# EAGLE design v5 (EAGLE 6.3)

## Sheet 1 of 3
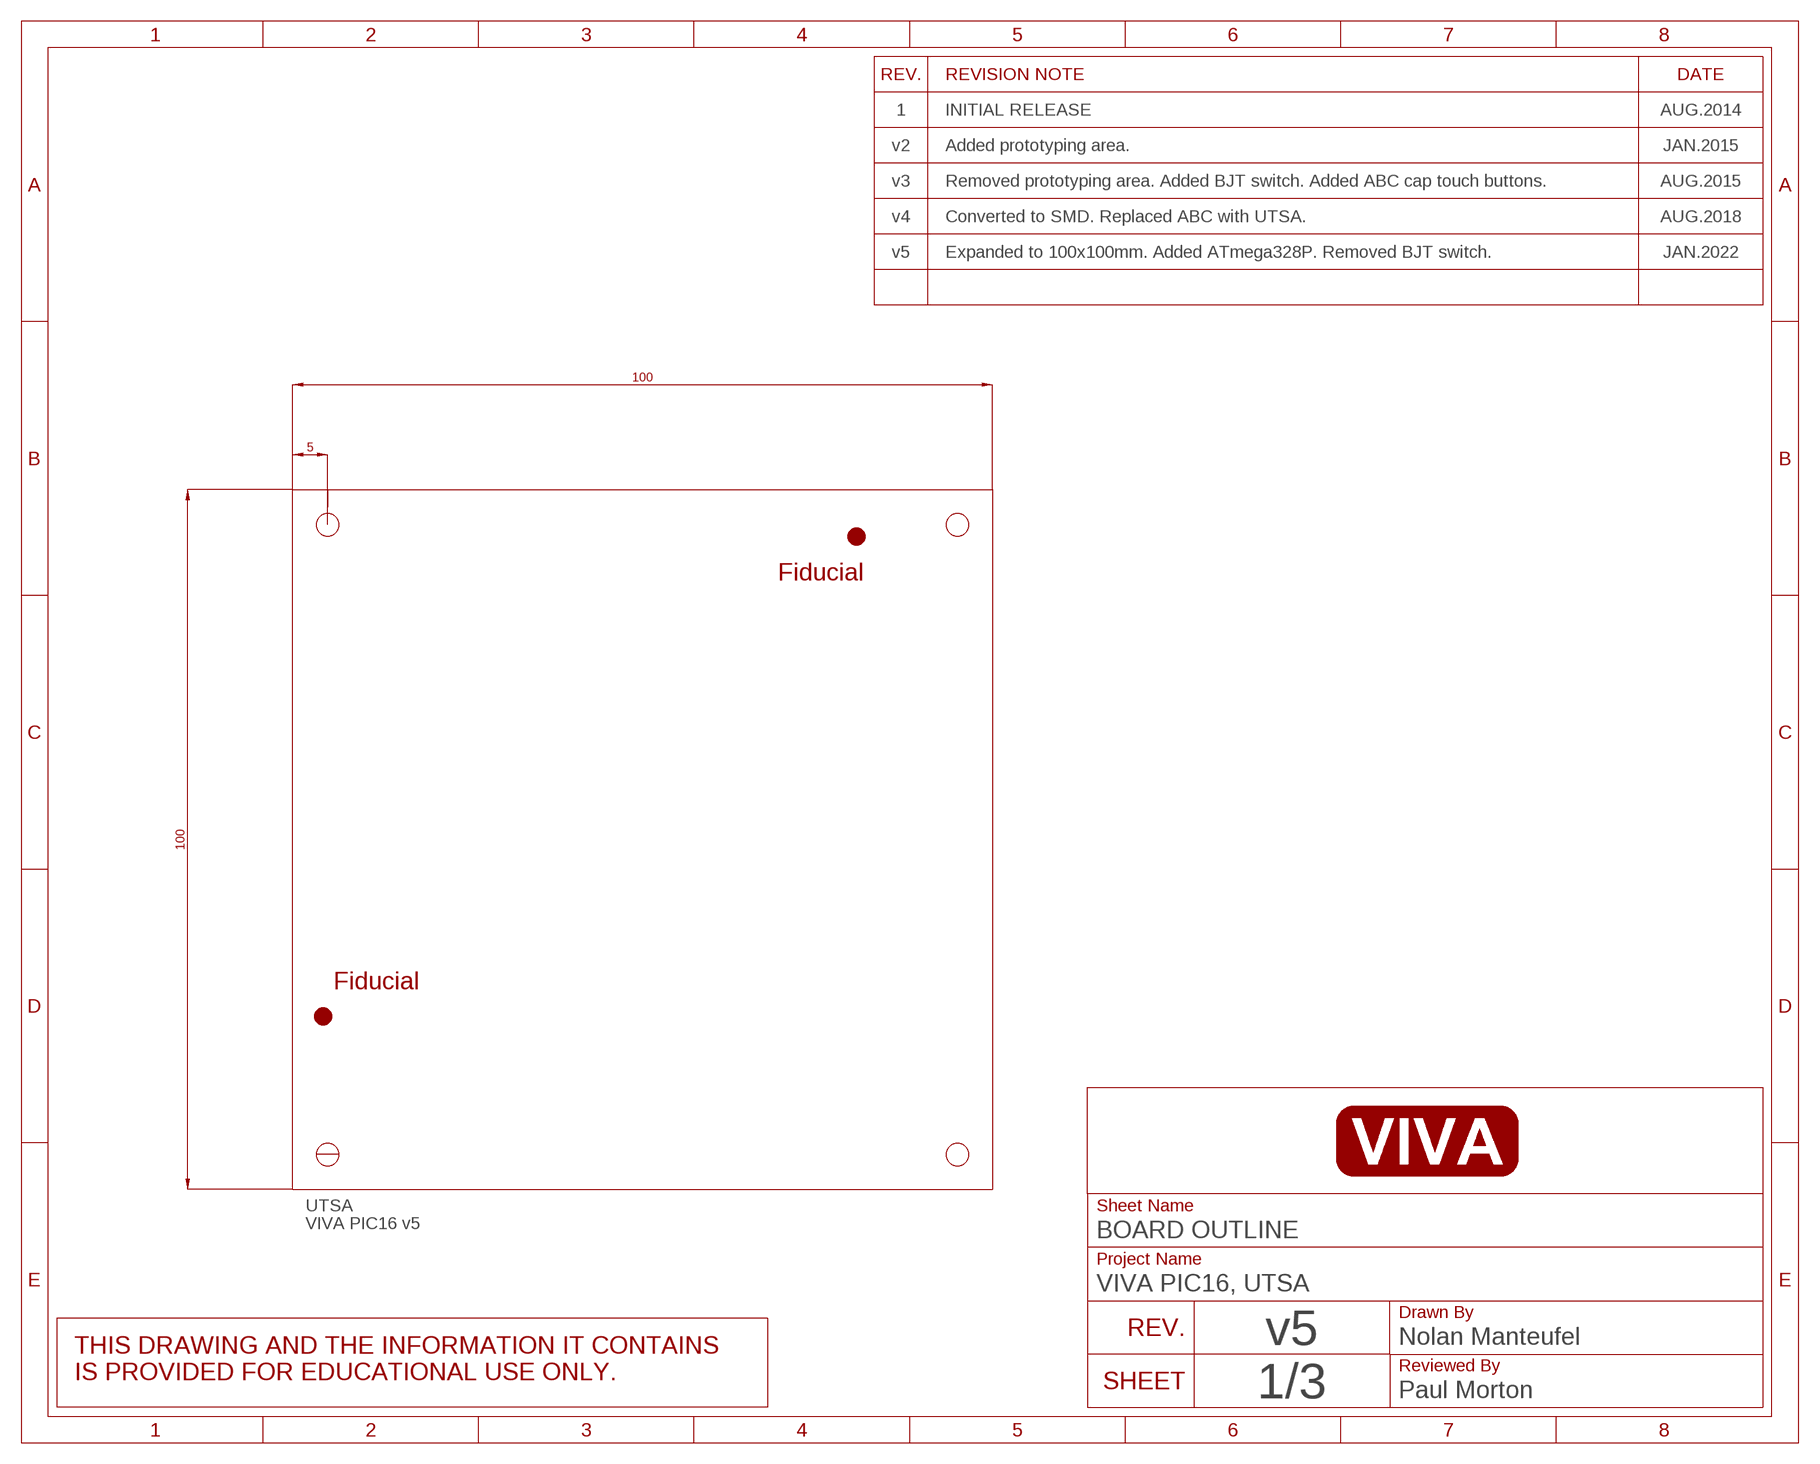
[diagram p0: schematic, sheet 1]
U$1 (SCHEMATIC_VIVA): DRAWN_BY: Nolan Manteufel; PROJECT: VIVA PIC16, UTSA; REVA: 1; REVA_DATE: AUG.2014; REVA_NOTE: INITIAL RELEASE; REVB: v2; REVB_DATE: JAN.2015; REVB_NOTE: Added prototyping area.; REVC: v3; REVC_DATE: AUG.2015; REVC_NOTE: Removed prototyping area. Added BJT switch. Added ABC cap touch buttons.; REVD: v4; REVD_DATE: AUG.2018; REVD_NOTE: Converted to SMD. Replaced ABC with UTSA.; REVE: v5; REVE_DATE: JAN.2022; REVE_NOTE: Expanded to 100x100mm. Added ATmega328P. Removed BJT switch.; REVIEWED_BY: Paul Morton; REVISION: v5

### Parts
A1  FIDUCIAL  [FIDUCIAL]
A2  FIDUCIAL  [FIDUCIAL]
UTSA  VIVA PIC16 v5  PCB_100X100  [PCB_100X100]

### Notes on the sheet
- Fiducial
- Fiducial

## Sheet 2 of 3
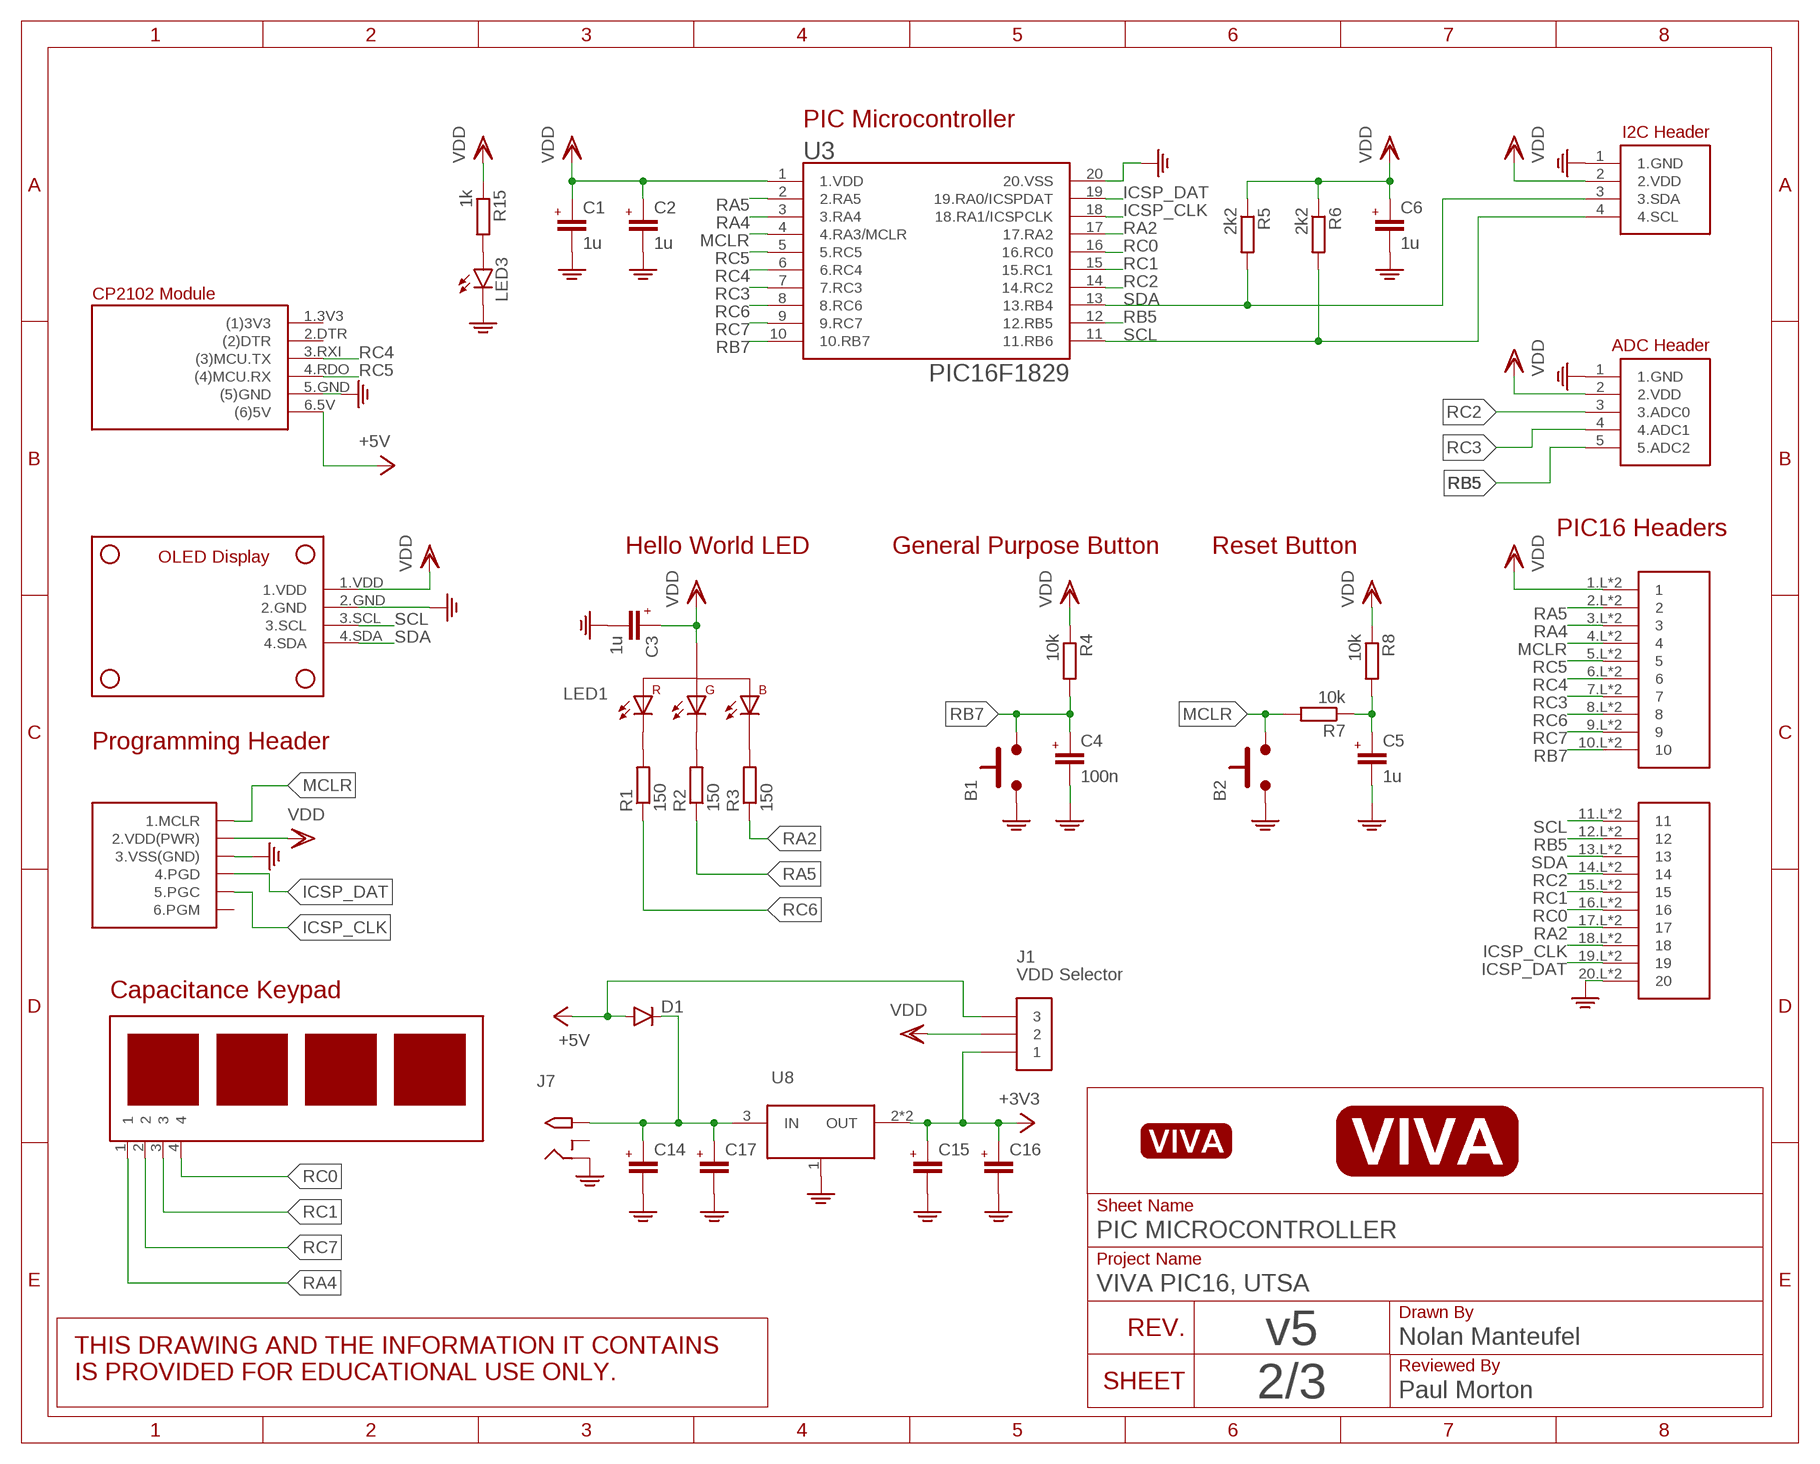
[diagram p1: schematic, sheet 2]
U$4 (SCHEMATIC_VIVA): DRAWN_BY: Nolan Manteufel; PROJECT: VIVA PIC16, UTSA; REVA: 1; REVA_DATE: AUG.2014; REVA_NOTE: INITIAL RELEASE; REVB: v2; REVB_DATE: JAN.2015; REVB_NOTE: Added prototyping area.; REVC: v3; REVC_DATE: AUG.2015; REVC_NOTE: Removed prototyping area. Added BJT switch. Added ABC cap touch buttons.; REVD: v4; REVD_DATE: AUG.2018; REVD_NOTE: Converted to SMD. Replaced ABC with UTSA.; REVE: v5; REVE_DATE: JAN.2022; REVE_NOTE: Expanded to 100x100mm. Added ATmega328P. Added battey pack.; REVIEWED_BY: Paul Morton; REVISION: v5

### Parts
B1  PUSHBUTTON6X6MM  [6X6MM]
B2  PUSHBUTTON6X6MM  [6X6MM]
C1  1u  C0805  [C0805]
C2  1u  C0805  [C0805]
C3  1u  C0805  [C0805]
C4  100n  C0805  [C0805]
C5  1u  C0805  [C0805]
C6  1u  C0805  [C0805]
C14  C0805  [C0805]
C15  C0805  [C0805]
C16  C0805  [C0805]
C17  C0805  [C0805]
D1  DIODE-DO214AC  [DO214AC]
J1  VDD Selector  PINS_3_2.54  [PINS_3]
J4  PICKIT3  [PICKIT3]
J5  VIVA-HEADER-ADC-PIC16  [VIVA-HEADER-ADC-PIC16]
J7  2.1MMJACKTHM  [PJ-102A]
LED1  LED_RGBLTST-C19FD1WT  [0805_RGB]
LED3  LEDSML0805  [SML0805]
R1  150  R-EU__R0805  [R0805]
R2  150  R-EU__R0805  [R0805]
R3  150  R-EU__R0805  [R0805]
R4  10k  R-EU__R0805  [R0805]
R5  2k2  R-EU__R0805  [R0805]
R6  2k2  R-EU__R0805  [R0805]
R7  10k  R-EU__R0805  [R0805]
R8  10k  R-EU__R0805  [R0805]
R15  1k  R-EU__R0805  [R0805]
U1  VIVA_UTSA-KEYPADV5  [VIVA_UTSA-KEYPAD-V5]
U2  VIVA_USB-TTL  [VIVA_USB_TTL_SUBTEXT]
U3  PIC16F1829  PIC16F1829300  [SOP20-NEW]
U4  VIVA-HEADER-I2C-RA  [VIVA-HEADER-I2C-RA]
U5  VIVA_PIC16BOARD  [VIVA_PIC16]
U8  REGULATOR_SCHLM1117  [SOT223]
U$2  VIVA_LOGO  [VIVA_LOGO]
U$3  VIVA_OLED  [VIVA_OLED-I2C]

### Nets
+3V3: C15.2(+) C16.2(+) J1.1 U8.2(OUT) U8.4.TAB(OUT)
+5V: D1.A J1.3 U2.6.5V((6)5V) ; also sheet 3
GND: B1.1.A B1.2.A B2.1.A B2.2.A C1.1(-) C2.1(-) C3.1(-) C4.1(-) C5.1(-) C6.1(-) C14.1(-) C15.1(-) C16.1(-) C17.1(-) J4.3(3.VSS(GND)) J5.1(1.GND) J7.RING LED3.C U2.5.GND((5)GND) U3.20(20.VSS) U4.1(1.GND) U5.20.L U5.20.R U8.1(GND) U$3.2.GND ; also sheet 3
ICSP_CLK: J4.5(5.PGC) U3.18(18.RA1/ICSPCLK) U5.18.L U5.18.R
ICSP_DAT: J4.4(4.PGD) U3.19(19.RA0/ICSPDAT) U5.19.L U5.19.R
MCLR: B2.3.B B2.4.B J4.1(1.MCLR) R7.2 U3.4(4.RA3/MCLR) U5.4.L U5.4.R
MCLR_CAP: C5.2(+) R7.1 R8.2
N$4: LED1.2(1.R-) R1.2
N$5: LED1.3(2.G-) R2.2
N$6: LED1.1(4.B-) R3.2
N$36: C14.2(+) C17.2(+) D1.C J7.TIP U8.3(IN)
N$38: LED3.A R15.2
RA2: R3.1 U3.17(17.RA2) U5.17.L U5.17.R
RA4: U1.1 U3.3(3.RA4) U5.3.L U5.3.R
RA5: R2.1 U3.2(2.RA5) U5.2.L U5.2.R
RB5: J5.5(5.ADC2) U3.12(12.RB5) U5.12.L U5.12.R
RB7: B1.3.B B1.4.B C4.2(+) R4.2 U3.10(10.RB7) U5.10.L U5.10.R
RC0: U1.4 U3.16(16.RC0) U5.16.L U5.16.R
RC1: U1.3 U3.15(15.RC1) U5.15.L U5.15.R
RC2: J5.3(3.ADC0) U3.14(14.RC2) U5.14.L U5.14.R
RC3: J5.4(4.ADC1) U3.7(7.RC3) U5.7.L U5.7.R
RC4: U2.3.RXI((3)MCU.TX) U3.6(6.RC4) U5.6.L U5.6.R
RC5: U2.4.RDO((4)MCU.RX) U3.5(5.RC5) U5.5.L U5.5.R
RC6: R1.1 U3.8(8.RC6) U5.8.L U5.8.R
RC7: U1.2 U3.9(9.RC7) U5.9.L U5.9.R
SCL: R6.2 U3.11(11.RB6) U4.4(4.SCL) U5.11.L U5.11.R U$3.3.SCL ; also sheet 3
SDA: R5.2 U3.13(13.RB4) U4.3(3.SDA) U5.13.L U5.13.R U$3.4.SDA ; also sheet 3
VDD: C1.2(+) C2.2(+) C3.2(+) C6.2(+) J1.2 J4.2(2.VDD(PWR)) J5.2(2.VDD) LED1.4(3.+) R4.1 R5.1 R6.1 R8.1 R15.1 U3.1(1.VDD) U4.2(2.VDD) U5.1.L U5.1.R U$3.1.VDD ; also sheet 3
Unconnected: J4.6(6.PGM) J7.RING_SW U2.1.3V3((1)3V3) U2.2.DTR((2)DTR)

### Notes on the sheet
- PIC Microcontroller
- PIC16 Headers
- Hello World LED | General Purpose Button | Reset Button
- Programming Header
- Capacitance Keypad

## Sheet 3 of 3
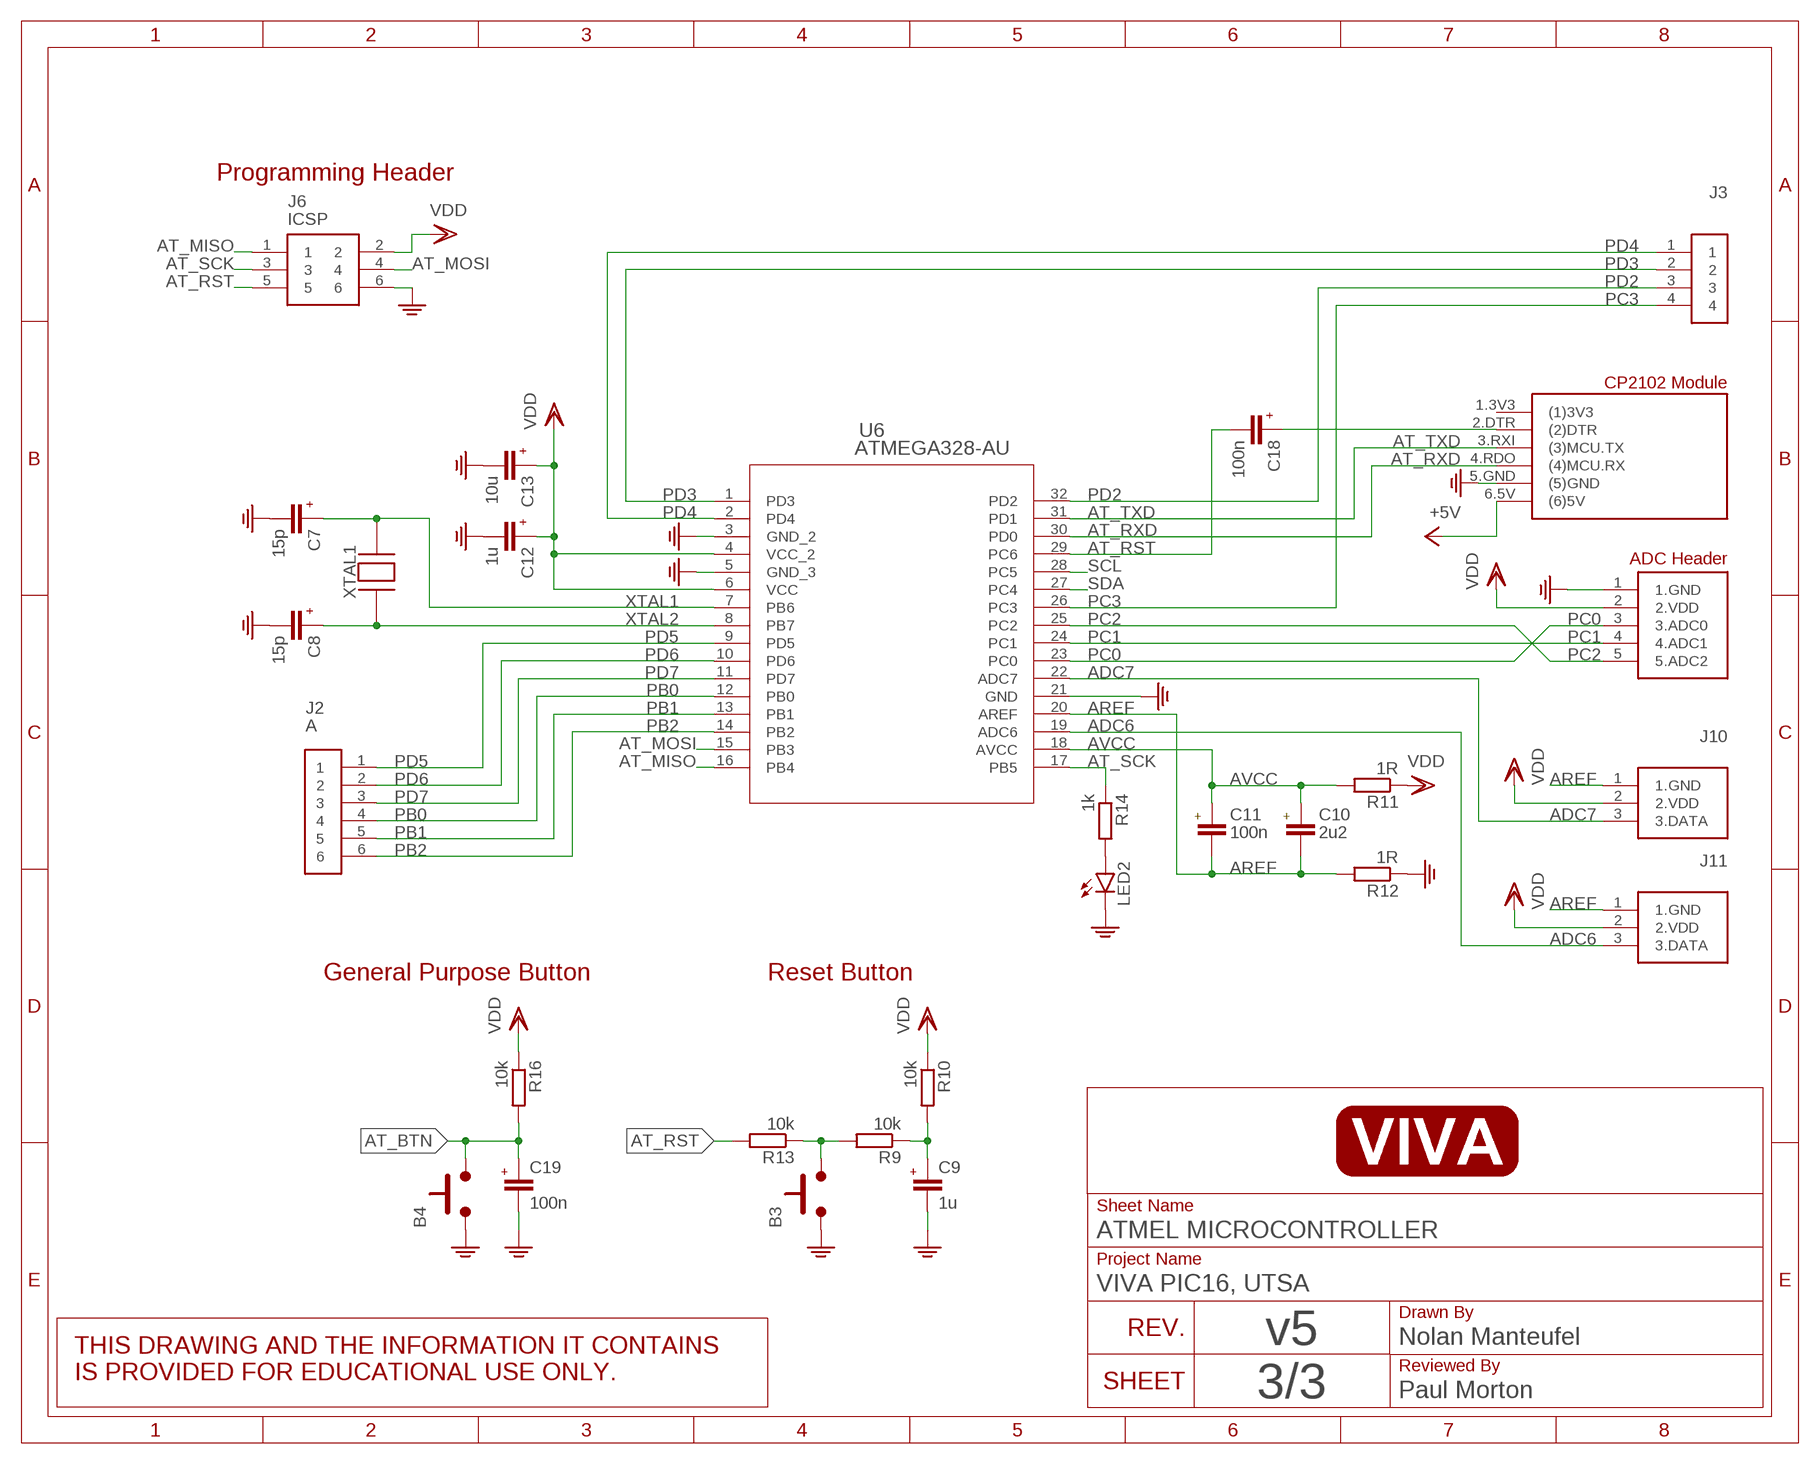
[diagram p2: schematic, sheet 3]
U$5 (SCHEMATIC_VIVA): DRAWN_BY: Nolan Manteufel; PROJECT: VIVA PIC16, UTSA; REVA: 1; REVA_DATE: AUG.2014; REVA_NOTE: INITIAL RELEASE; REVB: v2; REVB_DATE: JAN.2015; REVB_NOTE: Added prototyping area.; REVC: v3; REVC_DATE: AUG.2015; REVC_NOTE: Removed prototyping area. Added BJT switch. Added ABC cap touch buttons.; REVD: v4; REVD_DATE: AUG.2018; REVD_NOTE: Converted to SMD. Replaced ABC with UTSA.; REVE: v5; REVE_DATE: JAN.2022; REVE_NOTE: Expanded to 100x100mm. Added ATmega328P. Added battey pack.; REVIEWED_BY: Paul Morton; REVISION: v5

### Parts
B3  PUSHBUTTON6X6MM  [6X6MM]
B4  PUSHBUTTON6X6MM  [6X6MM]
C7  15p  C0603  [C0603]
C8  15p  C0603  [C0603]
C9  1u  C0805  [C0805]
C10  2u2  C-EU_C0805  [C0805]
C11  100n  C-EU_C0805  [C0805]
C12  1u  C0805  [C0805]
C13  10u  C0805  [C0805]
C18  100n  C0805  [C0805]
C19  100n  C0805  [C0805]
J2  A  PINS_6SQUARE  [PINS_6]
J3  PINS_4_0100  [PINS_4]
J6  ICSP  PINS_6-2X3  [PINS_6-2X3]
J9  VIVA-HEADER-ADC-PIC16  [VIVA-HEADER-ADC-PIC16]
J10  VIVA-HEADER-GPIO-1  [VIVA-HEADER-GPIO-RA-1]
J11  VIVA-HEADER-GPIO-1  [VIVA-HEADER-GPIO-RA-1]
LED2  LEDSML0805  [SML0805]
R9  10k  R-EU__R0805  [R0805]
R10  10k  R-EU__R0805  [R0805]
R11  1R  R-EU__R0805  [R0805]
R12  1R  R-EU__R0805  [R0805]
R13  10k  R-EU__R0805  [R0805]
R14  1k  R-EU__R0805  [R0805]
R16  10k  R-EU__R0805  [R0805]
U6  ATMEGA328-AU  [32A_ATM]
U7  VIVA_USB-TTL  [VIVA_USB_TTL_SUBTEXT]
XTAL1  CRYSTAL-SMD  [HC49S-SMD]

### Nets
+5V: U7.6.5V((6)5V) ; also sheet 2
ADC6: J11.3(3.DATA) U6.19(ADC6)
ADC7: J10.3(3.DATA) U6.22(ADC7)
AREF: C10.2 C11.2 J10.1(1.GND) J11.1(1.GND) R12.2 U6.20(AREF)
AT_BTN: B4.3.B B4.4.B C19.2(+) R16.2
AT_MISO: J6.1 U6.16(PB4)
AT_MOSI: J6.4 U6.15(PB3)
AT_RST: C18.1(-) J6.5 R13.2 U6.29(PC6)
AT_RST_BTN: B3.3.B B3.4.B R9.2 R13.1
AT_RST_CAP: C9.2(+) R9.1 R10.2
AT_RXD: U6.30(PD0) U7.4.RDO((4)MCU.RX)
AT_SCK: J6.3 R14.1 U6.17(PB5)
AT_TXD: U6.31(PD1) U7.3.RXI((3)MCU.TX)
AVCC: C10.1 C11.1 R11.2 U6.18(AVCC)
GND: B3.1.A B3.2.A B4.1.A B4.2.A C7.1(-) C8.1(-) C9.1(-) C12.1(-) C13.1(-) C19.1(-) J6.6 J9.1(1.GND) LED2.C R12.1 U6.3(GND_2) U6.5(GND_3) U6.21(GND) U7.5.GND((5)GND) ; also sheet 2
N$37: LED2.A R14.2
N$45: C18.2(+) U7.2.DTR((2)DTR)
PB0: J2.4 U6.12(PB0)
PB1: J2.5 U6.13(PB1)
PB2: J2.6 U6.14(PB2)
PC0: J9.3(3.ADC0) U6.23(PC0)
PC1: J9.4(4.ADC1) U6.24(PC1)
PC2: J9.5(5.ADC2) U6.25(PC2)
PC3: J3.4 U6.26(PC3)
PD2: J3.3 U6.32(PD2)
PD3: J3.2 U6.1(PD3)
PD4: J3.1 U6.2(PD4)
PD5: J2.1 U6.9(PD5)
PD6: J2.2 U6.10(PD6)
PD7: J2.3 U6.11(PD7)
SCL: U6.28(PC5) ; also sheet 2
SDA: U6.27(PC4) ; also sheet 2
VDD: C12.2(+) C13.2(+) J6.2 J9.2(2.VDD) J10.2(2.VDD) J11.2(2.VDD) R10.1 R11.1 R16.1 U6.4(VCC_2) U6.6(VCC) ; also sheet 2
XTAL1: C7.2(+) U6.7(PB6) XTAL1.2 XTAL1.4
XTAL2: C8.2(+) U6.8(PB7) XTAL1.1 XTAL1.3
Unconnected: U7.1.3V3((1)3V3)

### Notes on the sheet
- Programming Header
- General Purpose Button | Reset Button

## Library data of the parts
A1 A2 = utsa:FIDUCIAL
B1-B4 = nolan-utsa:PUSHBUTTON: Tactile push button switch
C1-C9 C12-C19 = utsa:C
C10 C11 = utsa:C-EU: CAPACITOR, European symbol
D1 = utsa:DIODE-: DIODE
J1 = utsa:PINS_3
J2 = utsa:PINS_6
J3 = utsa:PINS_4
J4 = nolan-viva:PICKIT3
J5 J9 = utsa:VIVA-HEADER-ADC
J6 = utsa:PINS_6-2X3
J7 = utsa:2.1MMJACK: 2.1mm x 5.5mm THM DC jack with internal switch. Digikey part #PJ-102A, 4UCON part #05537 2.1mm x 5.5mm SMT DC jack with internal switch. Digikey part #PJ-002A-SMT, 4UCON part #03267 By microbuilder.eu & adafruit.com
J10 J11 = utsa:VIVA-HEADER-GPIO-1
LED1 = utsa:LED_RGB
LED2 LED3 = utsa:LED: LED OSRAM: - CHIPLED LG R971, LG N971, LY N971, LG Q971, LY Q971, LO R971, LY R971 LH N974, LH R974 LS Q976, LO Q976, LY Q976 LO Q996 - Hyper CHIPLED LW Q18S LB Q993, LB Q99A, LB R99A - SideLED LS A670, LO A670, LY A670, LG A670, LP A670 LB A673, LV A673, LT A673, LW A673 LH A674 LY A675 LS A676, LA A676, LO A676, LY A676, LW A676 LS A679, LY A679, LG A679 - Hyper Micro SIDELED® LS Y876, LA Y876, LO Y876, LY Y876 LT Y87S - SmartLED LW L88C, LW L88S LB L89C, LB L89S, LG L890 LS L89K, LO L89K, LY L89K LS L896, LA L896, LO L896, LY L896 - TOPLED LS T670, LO T670, LY T670, LG T670, LP T670 LSG T670, LSP T670, LSY T670, LOP T670, LYG T670 LG T671, LOG T671, LSG T671 LB T673, LV T673, LT T673, LW T673 LH T674 LS T676, LA T676, LO T676, LY T676, LB T676, LH T676, LSB T676, LW T676 LB T67C, LV T67C, LT T67C, LS T67K, LO T67K, LY T67K, LW E67C LS E67B, LA E67B, LO E67B, LY E67B, LB E67C, LV E67C, LT E67C LW T67C LS T679, LY T679, LG T679 LS T770, LO T770, LY T770, LG T770, LP T770 LB T773, LV T773, LT T773, LW T773 LH T774 LS E675, LA E675, LY E675, LS T675 LS T776, LA T776, LO T776, LY T776, LB T776 LHGB T686 LT T68C, LB T68C - Hyper Mini TOPLED® LB M676 - Mini TOPLED Santana® LG M470 LS M47K, LO M47K, LY M47K Source: http://www.osram.convergy.de LUXEON: - LUMILED® LXK2-PW12-R00, LXK2-PW12-S00, LXK2-PW14-U00, LXK2-PW14-V00 LXK2-PM12-R00, LXK2-PM12-S00, LXK2-PM14-U00 LXK2-PE12-Q00, LXK2-PE12-R00, LXK2-PE12-S00, LXK2-PE14-T00, LXK2-PE14-U00 LXK2-PB12-K00, LXK2-PB12-L00, LXK2-PB12-M00, LXK2-PB14-N00, LXK2-PB14-P00, LXK2-PB14-Q00 LXK2-PR12-L00, LXK2-PR12-M00, LXK2-PR14-Q00, LXK2-PR14-R00 LXK2-PD12-Q00, LXK2-PD12-R00, LXK2-PD12-S00 LXK2-PH12-R00, LXK2-PH12-S00 LXK2-PL12-P00, LXK2-PL12-Q00, LXK2-PL12-R00 Source: www.luxeon.com KINGBRIGHT: KA-3528ASYC Source: www.kingbright.com
R1-R16 = utsa:R-EU_: RESISTOR, European symbol
U1 = utsa:VIVA_UTSA-KEYPAD
U2 U7 = utsa:VIVA_USB-TTL
U3 = utsa:PIC16F1829
U4 = utsa:VIVA-HEADER-I2C
U5 = utsa:VIVA_PIC16
U6 = utsa:ATMEGA328-AU; COPYRIGHT: Copyright (C) 2021 Ultra Librarian. All rights reserved.; MANUFACTURER_PART_NUMBER: ATMEGA328-AU; MFR_NAME: Microchip
U8 = utsa:REGULATOR_SCH: Linear Regulator in SOT-223 package. NOTE: select correct pinout for your application. Tab may be OUT or GND!
U$2 = utsa:VIVA_LOGO
U$3 = utsa:VIVA_OLED
UTSA = utsa:PCB_100X100
XTAL1 = utsa:CRYSTAL: HC49S Crystal Oscillator

## Board
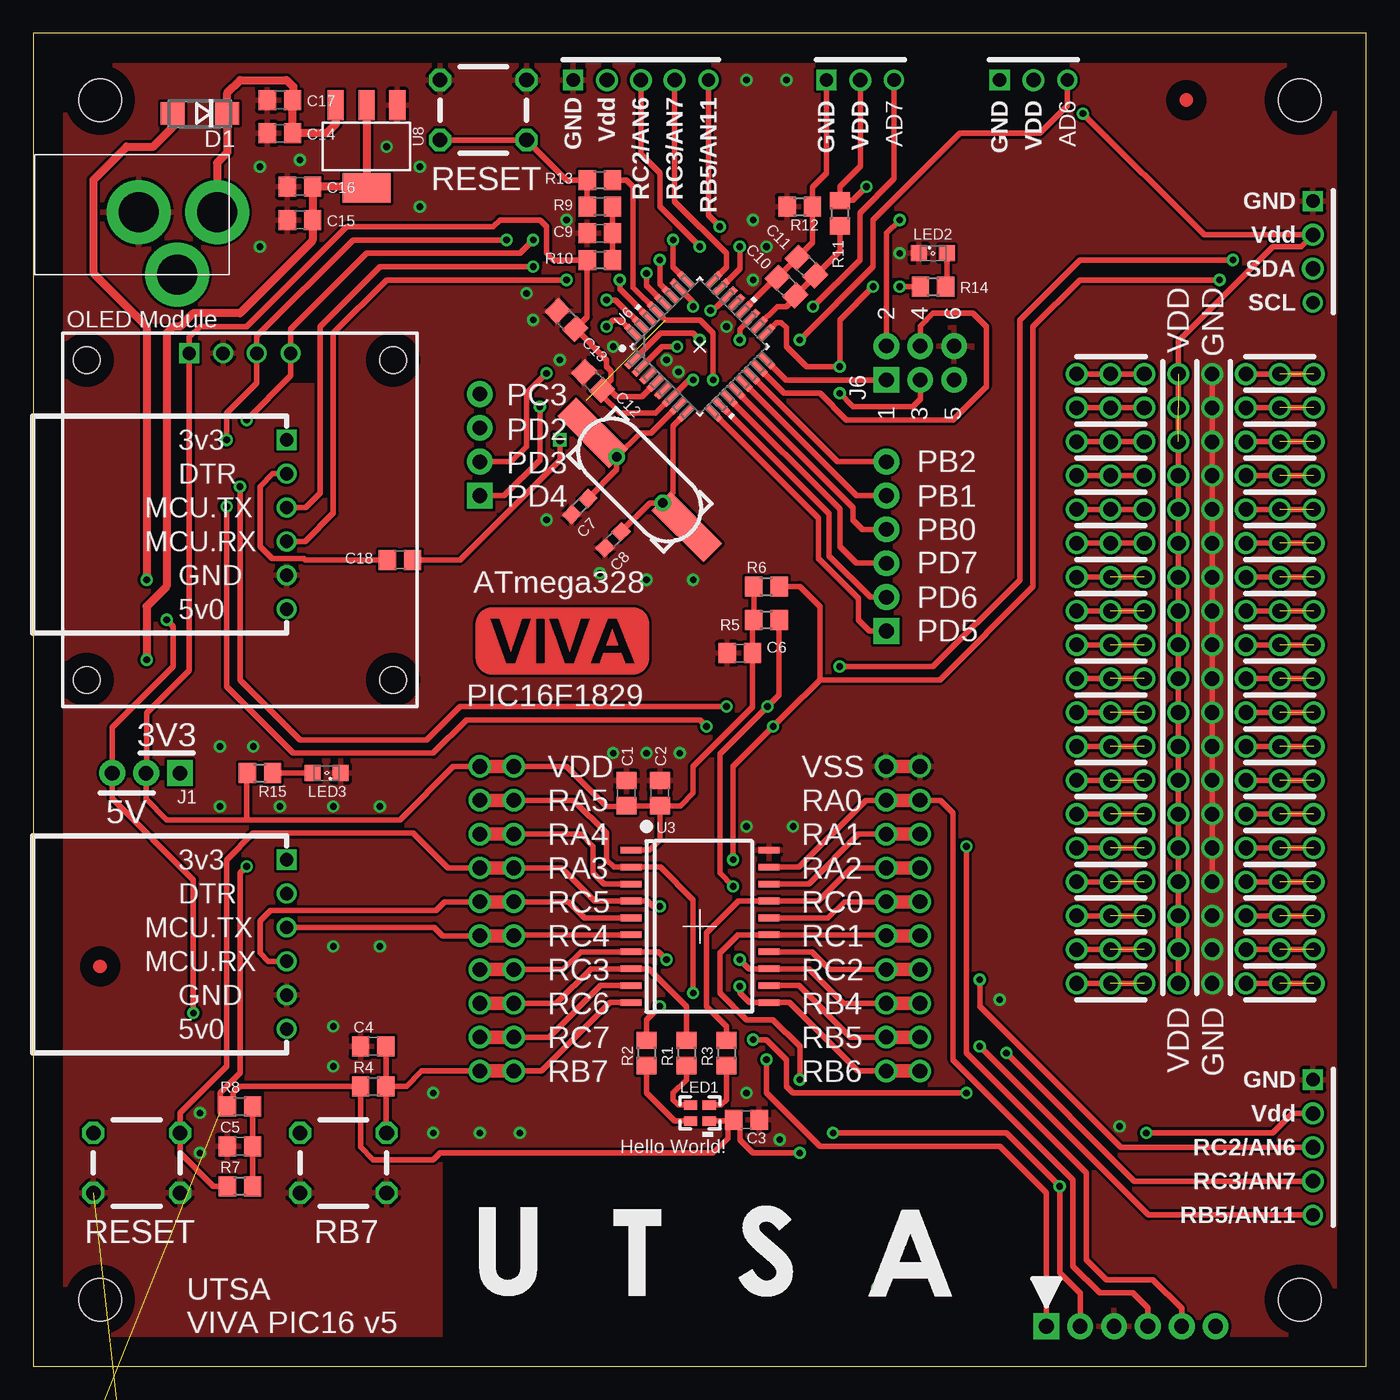
[diagram p3: board, top side]
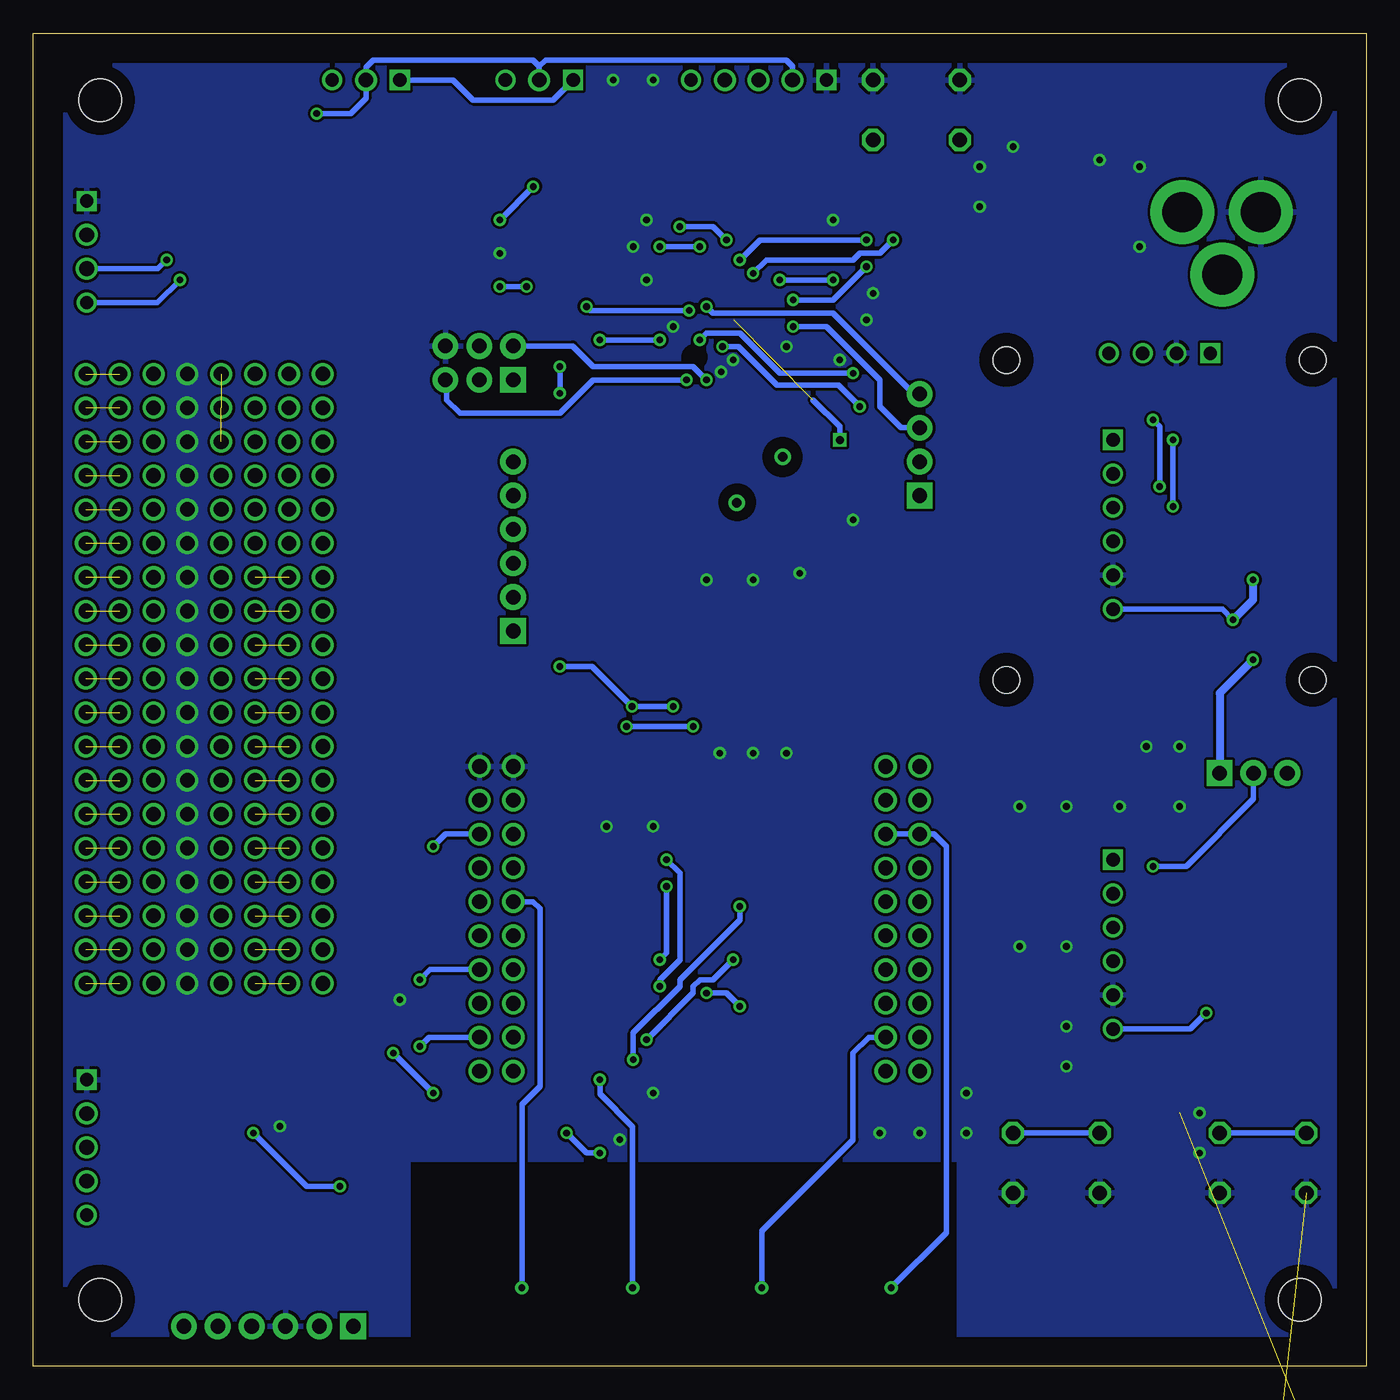
[diagram p4: board, bottom side, seen from below]

Size 100 x 100 mm. Coordinates in mm from the lower left corner, seen from the top.
Copper layers (1*2*15*16): Top 0.035mm / dielectric 0.2mm / Route2 0.035mm / dielectric 0.15mm / Route15 0.035mm / dielectric 0.2mm / Bottom 0.035mm
Design rules "default *": minimum track width 10mil, minimum drill 24mil, track to track 8mil, track to pad 8mil, pad to pad 8mil, via to via 8mil, smd to smd 8mil, copper to edge 40mil, drill to drill 8mil, minimum pad ring 10mil, minimum via ring 8mil, stop-mask expansion 4mil, vias tented up to drill 20mil, thermal gap 10mil
tRestrict: area 67.2,74.7 to 70.8,78.3; area 79.4,1.4 to 82.6,4.6; 2 lines
bRestrict: area 46,63.6 to 48.4,66; area 42.5,66.9 to 45.1,69.5; area 49.6,74.9 to 51.2,76.5

### Footprints (pad centres in the part's own frame; a part is rotated, then mirrored left to right if it is on the bottom)
FIDUCIAL = smd 0 x 0: FIDUCIAL 0,0
6X6MM = drill 1.1 octagon: 1.A 0,0; 2.A 6.5,0; 3.B 0,4.5; 4.B 6.5,4.5
C0805 = smd 1.3 x 1.5: 1 -0.95,0; 2 0.95,0
C0603 = smd 1.1 x 1: 1 -0.85,0; 2 0.85,0
DO214AC = smd 1.8 x 1.7: A 2.05,0; C -2.05,0
PINS_3 = drill 1.1 pad 1.93 square: 1 0,0 | drill 1.1 pad 1.93: 2 2.54,0; 3 5.08,0
PINS_6 = drill 1.1 pad 1.93 square: 1 0,0 | drill 1.1 pad 1.93: 2 2.54,0; 3 5.08,0; 4 7.62,0; 5 10.16,0; 6 12.7,0
PINS_4 = drill 1.1 pad 1.93 square: 1 0,0 | drill 1.1 pad 1.93: 2 2.54,0; 3 5.08,0; 4 7.62,0
PICKIT3 = drill 1.1 pad 1.93 square: 1 0,0 | drill 1.1 pad 1.93: 2 2.54,0; 3 5.08,0; 4 7.62,0; 5 10.16,0; 6 12.7,0
VIVA-HEADER-ADC-PIC16 = drill 1 square: 1 0,0 | drill 1.1: 2 2.54,0; 3 5.08,0; 4 7.62,0 | drill 1: 5 10.16,0
PINS_6-2X3 = drill 1.1 pad 1.93 square: 1 0,0 | drill 1.1 pad 1.93: 2 2.54,0; 3 0,-2.54; 4 2.54,-2.54; 5 0,-5.08; 6 2.54,-5.08
PJ-102A = drill 3 pad 4.8: RING 0.1,-3.39; RING_SW -4.6,-6.29; TIP 0.1,-9.29
VIVA-HEADER-GPIO-RA-1 = drill 1 square: 1 0,0 | drill 1.1: 2 0,-2.54 | drill 1: 3 0,-5.08
0805_RGB = smd 1 x 0.7: 1 0.7,0.6; 2 -0.7,0.6; 3 -0.7,-0.6; 4 0.7,-0.6
SML0805 = smd 1.2 x 1.2: A 1.05,0; C -1.05,0
R0805 = smd 1.3 x 1.5: 1 -0.95,0; 2 0.95,0
VIVA_UTSA-KEYPAD-V5 = drill 0.5: 1 -14.36,4.38; 2 -4.66,4.38; 3 5.04,4.38; 4 13.34,4.38
VIVA_USB_TTL_SUBTEXT = drill 1 square: 1.3V3 0,0 | drill 1: 2.DTR 0,-2.54; 3.RXI 0,-5.08; 4.RDO 0,-7.62; 5.GND 0,-10.16; 6.5V 0,-12.7
SOP20-NEW = smd 0.5 x 1.6: 1 -5.715,-5.152; 2 -4.445,-5.152; 3 -3.175,-5.152; 4 -1.905,-5.152; 5 -0.635,-5.152; 6 0.635,-5.152; 7 1.905,-5.152; 8 3.175,-5.152; 9 4.445,-5.152; 10 5.715,-5.152; 11 5.715,5.188; 12 4.445,5.188; 13 3.175,5.188; 14 1.905,5.188; 15 0.635,5.188; 16 -0.635,5.188; 17 -1.905,5.188; 18 -3.175,5.188; 19 -4.445,5.188; 20 -5.715,5.188
VIVA-HEADER-I2C-RA = drill 1 square: 1 0,0 | drill 1.1: 2 2.54,0; 3 5.08,0 | drill 1: 4 7.62,0
VIVA_PIC16 = drill 1.1 pad 1.676: 1.L 0,0; 1.R 2.54,0; 2.L 0,-2.54; 2.R 2.54,-2.54; 3.L 0,-5.08; 3.R 2.54,-5.08; 4.L 0,-7.62; 4.R 2.54,-7.62; 5.L 0,-10.16; 5.R 2.54,-10.16; 6.L 0,-12.7; 6.R 2.54,-12.7; 7.L 0,-15.24; 7.R 2.54,-15.24; 8.L 0,-17.78; 8.R 2.54,-17.78; 9.L 0,-20.32; 9.R 2.54,-20.32; 10.L 0,-22.86; 10.R 2.54,-22.86; 11.L 30.48,-22.86; 11.R 33.02,-22.86; 12.L 30.48,-20.32; 12.R 33.02,-20.32; 13.L 30.48,-17.78; 13.R 33.02,-17.78; 14.L 30.48,-15.24; 14.R 33.02,-15.24; 15.L 30.48,-12.7; 15.R 33.02,-12.7; 16.L 30.48,-10.16; 16.R 33.02,-10.16; 17.L 30.48,-7.62; 17.R 33.02,-7.62; 18.L 30.48,-5.08; 18.R 33.02,-5.08; 19.L 30.48,-2.54; 19.R 33.02,-2.54; 20.L 30.48,0; 20.R 33.02,0
32A_ATM = smd 1.461 x 0.501: 1 -4.25,2.8; 2 -4.25,2; 3 -4.25,1.2; 4 -4.25,0.4; 5 -4.25,-0.4; 6 -4.25,-1.2; 7 -4.25,-2; 8 -4.25,-2.8; 17 4.25,-2.8; 18 4.25,-2; 19 4.25,-1.2; 20 4.25,-0.4; 21 4.25,0.4; 22 4.25,1.2; 23 4.25,2; 24 4.25,2.8 | smd 0.501 x 1.461: 9 -2.8,-4.25; 10 -2,-4.25; 11 -1.2,-4.25; 12 -0.4,-4.25; 13 0.4,-4.25; 14 1.2,-4.25; 15 2,-4.25; 16 2.8,-4.25; 25 2.8,4.25; 26 2,4.25; 27 1.2,4.25; 28 0.4,4.25; 29 -0.4,4.25; 30 -1.2,4.25; 31 -2,4.25; 32 -2.8,4.25
SOT223 = smd 1.219 x 2.235: 1 -2.311,-3.099; 2 0,-3.099; 3 2.311,-3.099 | smd 3.6 x 2.2: 4.TAB 0,3.099
VIVA_OLED-I2C = drill 1 square: 1.VDD -3.81,12.5 | drill 1: 2.GND -1.27,12.5; 3.SCL 1.27,12.5; 4.SDA 3.81,12.5 | hole 2: -11.5,12; 11.5,12; -11.5,-12; 11.5,-12
PCB_100X100 = hole 3.2: 5,95; 95,95; 95,5; 5,5
HC49S-SMD = drill 0.7: 1 -2.44,0; 2 2.44,0 | smd 5.5 x 2: 3 -5,0; 4 5,0

### Placement (x,y rotation side)
A1  86.5,95 0 top
A2  5,30 0 top
B1  20,13 0 top
B2  4.5,13 0 top
B3  37,96.5 180 top
B4  0.5,-9.5 0 top  (outside the outline)
C1  44.5,43 270 top
C2  47,43 270 top
C3  53.5,18.5 180 top
C4  25.5,24 0 top
C5  15.5,16.5 0 top
C6  53,53.5 0 top
C7  41,64.5 45 top
C8  43.5,62 45 top
C9  42.5,85 0 top
C10  56.5,81 135 top
C11  58,82.5 135 top
C12  42,73.9 315 top
C13  40,78.5 315 top
C14  18.5,92.5 0 top
C15  20,86 0 top
C16  20,88.5 0 top
C17  18.5,95 0 top
C18  27.5,60.5 180 top
C19  1.5,-12 0 top  (outside the outline)
D1  12.5,94 180 top
J1  11,44.5 180 top
J2  64,55.16 90 top
J3  33.5,65.32 90 top
J4  76,3 0 top
J5  96,21.5 270 top
J6  64,74 90 top
J7  4.5,86.5 90 top
J9  40.5,96.5 0 top
J10  59.5,96.5 90 top
J11  72.5,96.5 90 top
LED1  50,19 0 top
LED2  67.5,83.5 0 top
LED3  22,44.5 180 top
R1  49,23.5 270 top
R2  46,23.5 270 top
R3  52,23.5 270 top
R4  25.5,21 0 top
R5  55,56 0 top
R6  55,58.5 0 top
R7  15.5,13.5 180 top
R8  15.5,19.5 0 top
R9  42.5,87 180 top
R10  42.5,83 0 top
R11  60.5,86.5 270 top
R12  57.5,87 0 top
R13  42.5,89 0 top
R14  67.5,81 0 top
R15  17,44.5 0 top
R16  1.5,-14.5 0 top  (outside the outline)
U1  50,1.5 0 top
U2  19,38 0 top
U3  50,33 270 top
U4  96,87.42 270 top
U5  33.5,45 0 top
U6  50,76.5 45 top
U7  19,69.5 0 top
U8  25,91.5 180 top
U$2  33.2,51.9 0 top
U$3  15.5,63.5 0 top
UTSA  0,0 0 top
XTAL1  45.5,66.5 135 top

### Tracks (layer width: path | path; a pad name or v marks a point on that pad's centre or on a via)
+3V3  (via drill 0.5)
  Top 0.61: U8.2 U8.4.TAB 23.9,88.4 23.5,88.5 C16.2 C15.2 20.95,84.45 15.5,79 12,79 11,78 10.5,78 10,77.5 10,58.5 8.5,57 v8.5,53
  Bottom 0.61: v8.5,53 11,50.5 J1.1
+5V  (via drill 0.5)
  Top 0.406: v12,26.5 12,36.5 5.92,42.58 J1.3 5.92,47.92 10.5,52.5 10.5,55.5 v10,56
  Top 0.61: v8.5,59 8.5,78 4.5,82 4.5,89 7,91.5 9,91.5 10.45,92.95 D1.A
  Bottom 0.406: U2.6.5V 13.2,25.3 v12,26.5 | v10,56 10.8,56.8 U7.6.5V
  Bottom 0.61: v8.5,59 8.5,57.5 v10,56
ADC6  (via drill 0.5)
  Top 0.406: U6.19 53,77.8 v53,77 | v57.5,77 63,82.5 63,86 69.5,92.5 75.5,92.5 77.58,94.58 J11.3
  Bottom 0.406: v53,77 v57.5,77
ADC7  (via drill 0.5)
  Top 0.406: U6.22 51.3,79.5 v50.8,79.2 | v58.5,79.5 62,83 62,86.5 64.58,89.08 J10.3
  Bottom 0.406: v50.8,79.2 58.2,79.2 v58.5,79.5
AREF
  Top 0.406: U6.20 55.74,81.67 C10.2 C11.2 58.45,84.29 R12.2 58.45,88.45 59.5,89.5 J10.1
  Bottom 0.406: J11.1 68.5,96.5 67,95 61,95 J10.1
AT_BTN  (3 unrouted)
AT_MISO
  Top 0.406: J6.1 56.46,74 U6.16
AT_MOSI
  Top 0.406: J6.4 66.54,78.04 67.5,79 70.5,79 71.5,78 71.5,73.5 69,71 61,71 59,73 56.33,73 U6.15
AT_RST  (via drill 0.5, 0.6)  (1 unrouted)
  Top 0.406: R13.2 44.5,89 45,88.5 45,80.93 U6.29 47.43,78.5 50,78.5 51,77.5 v51,74 | C18.1 32,60.5 39.5,68 v39.5,69.5
  Bottom 0.406: J6.5 69,73.92 69,72.5 68,71.5 60.5,71.5 58,74 v51,74 | v39.5,69.5 39.5,70.5 41.5,72.5
AT_RST_BTN
  Top 0.406: R9.2 R13.1 40,89 B3.3.B B3.4.B
AT_RST_CAP
  Top 0.406: R9.1 C9.2 R10.2
AT_RXD  (via drill 0.5)
  Top 0.406: U7.4.RDO 20.38,61.88 22.5,64 22.5,77.5 26.5,81.5 v40,81.5 | U6.30 44,80.8 v44,81.5
  Bottom 0.406: v44,81.5 v40,81.5
AT_SCK  (via drill 0.5)
  Top 0.406: J6.3 66.54,72.54 66,72 61.5,72 v60.5,73 | U6.17 55.76,78.3 56.1,78.3 56.5,77.9 56.5,76.5 58,75 v60.5,75 60.5,78.5 v63,81 | R14.1 v65,81
  Bottom 0.406: v60.5,73 v60.5,75 | v65,81 v63,81
AT_TXD  (via drill 0.5)
  Top 0.406: U7.3.RXI 20.42,64.42 21.5,65.5 21.5,78 26,82.5 v37.5,82.5 | U6.31 43.67,80 v43,80
  Bottom 0.406: v43,80 40,80 v37.5,82.5
AVCC
  Top 0.406: U6.18 55.83,79.5 56.5,79.5 57.17,80.17 C10.1 C11.1 60.5,83.66 R11.2
GND  (via drill 0.5, 1.1)  (3 unrouted)
  Top 0.406: v88.44,36.34 v88.44,74.44
  other vias: 53.5,40.5 57,40.5 72.5,27.5 56,17 53.5,20.5 43.5,46 46,46 48.5,46 12.5,19 12.5,16 30,20.5 30,17.5 33.5,17.5 36.5,17.5 22.5,22.5 22.5,25.5 22.5,31.5 26,31.5 26,42 22.5,42 54,81.5 55,84 53.5,96.5 47.5,75.5 48.4,74.6 38.5,63.5 42.5,59.5 37.5,78.5 40,86 81.5,18 52,78 37,80.5 39.5,75.5 88.44,71.9 88.44,69.36 88.44,66.82 88.44,64.28 88.44,61.74 88.44,59.2 88.44,56.66 88.44,54.12 88.44,51.58 88.44,49.04 88.44,46.5 88.44,43.96 88.44,41.42 88.44,38.88 43.5,76.5 65,83.5 56.5,96.5 54,86 16.5,46.5 14,46.5 18.5,42 14,42 26.5,91.5 29,90 17,90 29,87 17,84 20,90.5 49.5,59 46,59 88.44,33.8 88.44,31.26 88.44,28.72
  pour Top: 2,2 98,2 98,98 2,98
  pour Bottom: 2,2 98,2 98,98 2,98
ICSP_CLK  (via drill 0.5)
  Top 0.406: U5.18.L 61.92,39.92 58.17,36.17 U3.18 | J4.5 86.16,4.34 84,6.5 80.5,6.5 79,8 79,14.5 70,23.5 v70,39
  Bottom 0.406: v70,39 69.08,39.92 U5.18.R
ICSP_DAT
  Top 0.406: U3.19 57.45,37.45 62.46,42.46 U5.19.R 68.04,42.46 69,41.5 69,23 78,14 78,7.5 80,5.5 82.5,5.5 83.62,4.38 J4.4
MCLR  (via drill 0.5)
  Top 0.406: J4.1 76,13 72.5,16.5 59,16.5 55,20.5 v55,23 | R7.2 13.5,13.5 11,16 B2.4.B 11,19 14.5,22.5 14.5,38 16.5,40 28.5,40 31.12,37.38 U5.4.L 39.62,37.38 42.09,34.91 U3.4 46.09,34.91 46.5,34.5 v47,34.5
  Bottom 0.406: v55,23 55,25 51.5,28.5 51.5,29 47,33.5 v47,34.5 | B2.3.B B2.4.B
MCLR_CAP
  Top 0.406: R7.1 C5.2 R8.2
N$1  (via drill 1.1)  (1 unrouted)
  Top 0.406: v90.98,36.34 v96.06,36.34
  other vias: 93.52,36.34
N$2  (via drill 1.1)  (1 unrouted)
  Top 0.406: v90.98,38.88 v96.06,38.88
  other vias: 93.52,38.88
N$3  (via drill 1.1)  (1 unrouted)
  Top 0.406: v90.98,41.42 v96.06,41.42
  other vias: 93.52,41.42
N$4
  Top 0.406: LED1.2 48.4,19.6 48,20 48,20.5 49,21.5 R1.2
N$5
  Top 0.406: LED1.3 48.1,18.4 46,20.5 R2.2
N$6
  Top 0.406: R3.2 52,20 51.6,19.6 LED1.1
N$7  (via drill 1.1)  (1 unrouted)
  Top 0.406: v90.98,43.96 v96.06,43.96
  other vias: 93.52,43.96
N$8  (via drill 1.1)  (1 unrouted)
  Top 0.406: v90.98,46.5 v96.06,46.5
  other vias: 93.52,46.5
N$9  (via drill 1.1)  (1 unrouted)
  Top 0.406: v90.98,49.04 v96.06,49.04
  other vias: 93.52,49.04
N$10  (via drill 1.1)  (1 unrouted)
  Top 0.406: v90.98,51.58 v96.06,51.58
  other vias: 93.52,51.58
N$11  (via drill 1.1)  (1 unrouted)
  Top 0.406: v90.98,54.12 v96.06,54.12
  other vias: 93.52,54.12
N$12  (via drill 1.1)  (1 unrouted)
  Top 0.406: v90.98,56.66 v96.06,56.66
  other vias: 93.52,56.66
N$13  (via drill 1.1)  (1 unrouted)
  Top 0.406: v90.98,59.2 v96.06,59.2
  other vias: 93.52,59.2
N$14  (via drill 1.1)  (1 unrouted)
  Top 0.406: v90.98,61.74 v96.06,61.74
  other vias: 93.52,61.74
N$15  (via drill 1.1)  (1 unrouted)
  Top 0.406: v90.98,64.28 v96.06,64.28
  other vias: 93.52,64.28
N$16  (via drill 1.1)  (1 unrouted)
  Top 0.406: v90.98,66.82 v96.06,66.82
  other vias: 93.52,66.82
N$17  (via drill 1.1)  (1 unrouted)
  Top 0.406: v90.98,69.36 v96.06,69.36
  other vias: 93.52,69.36
N$18  (via drill 1.1)  (1 unrouted)
  Top 0.406: v90.98,71.9 v96.06,71.9
  other vias: 93.52,71.9
N$19  (via drill 1.1)  (1 unrouted)
  Top 0.406: v90.98,74.44 v96.06,74.44
  other vias: 93.52,74.44
N$20  (via drill 1.1)  (1 unrouted)
  Top 0.406: v78.28,36.34 v83.36,36.34
  other vias: 80.82,36.34
N$21  (via drill 1.1)  (1 unrouted)
  Top 0.406: v78.28,38.88 v83.36,38.88
  other vias: 80.82,38.88
N$22  (via drill 1.1)  (1 unrouted)
  Top 0.406: v78.28,41.42 v83.36,41.42
  other vias: 80.82,41.42
N$23  (via drill 1.1)  (1 unrouted)
  Top 0.406: v78.28,43.96 v83.36,43.96
  other vias: 80.82,43.96
N$24  (via drill 1.1)  (1 unrouted)
  Top 0.406: v78.28,46.5 v83.36,46.5
  other vias: 80.82,46.5
N$25  (via drill 1.1)  (1 unrouted)
  Top 0.406: v78.28,49.04 v83.36,49.04
  other vias: 80.82,49.04
N$26  (via drill 1.1)  (1 unrouted)
  Top 0.406: v78.28,51.58 v83.36,51.58
  other vias: 80.82,51.58
N$27  (via drill 1.1)  (1 unrouted)
  Top 0.406: v78.28,54.12 v83.36,54.12
  other vias: 80.82,54.12
N$28  (via drill 1.1)  (1 unrouted)
  Top 0.406: v78.28,56.66 v83.36,56.66
  other vias: 80.82,56.66
N$29  (via drill 1.1)  (1 unrouted)
  Top 0.406: v78.28,59.2 v83.36,59.2
  other vias: 80.82,59.2
N$30  (via drill 1.1)
  Top 0.406: v78.28,61.74 v80.82,61.74 v83.36,61.74
N$31  (via drill 1.1)
  Top 0.406: v78.28,64.28 v80.82,64.28 v83.36,64.28
N$32  (via drill 1.1)
  Top 0.406: v78.28,66.82 v80.82,66.82 v83.36,66.82
N$33  (via drill 1.1)
  Top 0.406: v78.28,69.36 v80.82,69.36 v83.36,69.36
N$34  (via drill 1.1)
  Top 0.406: v78.28,71.9 v80.82,71.9 v83.36,71.9
N$35  (via drill 1.1)
  Top 0.406: v78.28,74.44 v80.82,74.44 v83.36,74.44
N$36
  Top 0.61: J7.TIP 13.79,90.29 14.55,91.05 D1.C 14.55,95.55 15.5,96.5 19,96.5 19.5,96 19.5,94.65 C17.2 C14.2 22,92.5 22.69,93.19 U8.3
N$37
  Top 0.406: R14.2 68.55,81.1 LED2.A
N$38
  Top 0.406: LED3.A R15.2
N$39  (via drill 1.1)  (1 unrouted)
  Top 0.406: v78.28,28.72 v83.36,28.72
  other vias: 80.82,28.72
N$40  (via drill 1.1)  (1 unrouted)
  Top 0.406: v78.28,31.26 v83.36,31.26
  other vias: 80.82,31.26
N$41  (via drill 1.1)  (1 unrouted)
  Top 0.406: v78.28,33.8 v83.36,33.8
  other vias: 80.82,33.8
N$42  (via drill 1.1)  (1 unrouted)
  Top 0.406: v90.98,28.72 v96.06,28.72
  other vias: 93.52,28.72
N$43  (via drill 1.1)  (1 unrouted)
  Top 0.406: v90.98,31.26 v96.06,31.26
  other vias: 93.52,31.26
N$44  (via drill 1.1)  (1 unrouted)
  Top 0.406: v90.98,33.8 v96.06,33.8
  other vias: 93.52,33.8
N$45
  Top 0.406: C18.2 20.4,60.5 20.3,60.6 17.9,60.6 17,61.5 17,66 17.96,66.96 U7.2.DTR
PB0
  Top 0.406: U6.12 61.5,64.43 61.5,63.5 62.22,62.78 J2.4
PB1
  Top 0.406: U6.13 61.75,65.32 J2.5
PB2
  Top 0.406: U6.14 60.34,67.86 J2.6
PC0  (via drill 0.5)
  Top 0.406: U6.23 53,82.33 v53,84 | v50,84 47,87 47,89.5 45.58,90.92 J9.3
  Bottom 0.406: v53,84 v50,84
PC1
  Top 0.406: U6.24 52,82.46 52,83.5 48.12,87.38 J9.4
PC2  (via drill 0.5)
  Top 0.406: U6.25 48,82.46 v48,84.5 | v51.5,85.5 50.66,86.34 J9.5
  Bottom 0.406: v48,84.5 49,85.5 v51.5,85.5
PC3  (via drill 0.5)
  Top 0.406: v49.5,79.5 49.5,79.83 U6.26
  Bottom 0.406: v49.5,79.5 49,79 40,79 33.94,72.94 J3.4
PD2  (via drill 0.5)
  Top 0.406: v43,78 43.5,78.5 44.04,78.5 U6.32
  Bottom 0.406: J3.3 34.9,70.4 36.5,72 36.5,74 40.5,78 v43,78
PD3  (via drill 0.5)
  Top 0.406: U6.1 47.04,77.5 49.5,77.5 v50,77 | v38.5,74.5 37,73 37,69 35.86,67.86 J3.2
  Bottom 0.406: v50,77 49.5,77.5 47,77.5 44,74.5 v38.5,74.5
PD4  (via drill 0.5)
  Top 0.406: U6.2 47.17,76.5 v48.3,76.5 | v38,72 38,68 35.32,65.32 J3.1
  Bottom 0.406: v48.3,76.5 47.1,76.5 44.2,73.6 39.6,73.6 v38,72
PD5
  Top 0.406: U6.9 58.9,63.64 58.9,60.6 61.9,57.6 61.9,56 62.74,55.16 J2.1
PD6
  Top 0.406: U6.10 59.7,63.97 59.7,60.8 62.8,57.7 J2.2
PD7
  Top 0.406: U6.11 60.5,64.3 60.5,61.5 61.76,60.24 J2.3
RA2
  Top 0.406: U5.17.L 61.38,37.38 58.91,34.91 U3.17 52.91,34.91 50.5,32.5 50.5,27 52,25.5 R3.1
RA4
  Top 0.406: U5.3.R 41.08,39.92 42,39 42,37 42.83,36.17 U3.3
  Bottom 0.406: U5.3.R 32.42,39.92 31.5,39 31.5,10.02 U1.1
RA5  (via drill 0.5)
  Top 0.406: U5.2.R 40.54,42.46 43,40 43,38 43.55,37.45 U3.2 47.05,37.45 49.5,35 v49.5,28 | v47,27 46,26 R2.1
  Bottom 0.406: v49.5,28 48,28 v47,27
RB5  (via drill 0.5)
  Top 0.406: U5.12.R 61.32,24.68 57.45,28.55 U3.12 | J5.5 83.66,11.34 v71,24
  Bottom 0.406: v71,24 70.32,24.68 U5.12.R
RB7
  Top 0.406: U3.10 43.28,27.29 38.14,22.14 U5.10.R 29.14,22.14 28,21 R4.2 | C4.2 R4.2 | R4.2 26.45,17.55 B1.4.B
  Bottom 0.406: B1.3.B B1.4.B
RC0
  Top 0.406: U5.16.L 60.84,34.84 59.63,33.63 U3.16
  Bottom 0.406: U5.16.L 62.5,34.84 62,34.34 62,21 63.34,19.66 U1.4
RC1  (via drill 0.5)
  Top 0.406: 63.98,32.37 U5.15.L arc90 63.91,32.37 U3.15 52.87,32.37 51.5,31 51.5,28 53.5,26 55.5,26 57.5,24 v57.5,21.5
  Bottom 0.406: U1.3 55.04,17.96 57.5,20.42 v57.5,21.5
RC2  (via drill 0.5)
  Top 0.406: U5.14.R 59.74,29.76 58.41,31.09 U3.14 | J5.3 81.58,16.42 71,27 v71,29
  Bottom 0.406: v71,29 70.24,29.76 U5.14.R
RC3  (via drill 0.5)
  Top 0.406: U5.7.R 39.76,29.76 41.09,31.09 U3.7 46.91,31.09 v47.5,30.5 | J5.4 82.62,13.88 v73,23.5 | v70,20.5 57,20.5 56.5,21 56.5,23 55,24.5 v54,24.5
  Bottom 0.406: v47.5,30.5 49,29 50,29 50.5,28.5 50.5,28 v54,24.5 | v73,23.5 v70,20.5
RC4
  Top 0.406: 36.1,32.37 U5.6.R | U3.6 36.1,32.37 | 36.1,32.37 arc90 U5.6.R | U2.3.RXI 30.08,32.92 30.7,32.3 U5.6.R
RC5
  Top 0.406: U3.5 41.37,33.63 40.16,34.84 U5.5.L 30.84,34.84 30.2,34.2 17.8,34.2 17,33.4 17,31 17.62,30.38 U2.4.RDO
RC6
  Top 0.406: U5.8.L 39.22,27.22 41.83,29.82 U3.8 46.17,29.82 49,27 R1.1
RC7
  Top 0.406: U5.9.R 38.68,24.68 42.55,28.55 U3.9
  Bottom 0.406: U5.9.R 37.32,24.68 38.5,23.5 38.5,17 45.34,10.16 U1.2
SCL  (via drill 0.5)
  Top 0.406: U5.11.L 61.86,22.14 56.72,27.29 U3.11 53.72,27.29 53,28 v53,28.5 | U6.28 46,81.07 v46,82 | v35.5,84.5 24,84.5 16.77,77.27 U$3.3.SCL 16.77,73.77 14.5,71.5 v14.5,69.5 | v14.5,64.5 14.5,51 19.5,46 30,46 32.5,48.5 50,48.5 v50.5,48 | v52.5,38 52.5,45 v55.5,48 56.5,49 59,51.5 | 59,51.5 59,57 57.5,58.5 R6.2 | v89,81.5 78.5,81.5 75,78 75,58.5 68,51.5 59,51.5
  Bottom 0.406: v46,82 45,83 38.5,83 38,83.5 36.5,83.5 v35.5,84.5 | v52.5,38 51.5,37 51.5,30.5 53,29 v53,28.5 | v14.5,64.5 v14.5,69.5 | U4.4 90.7,79.8 v89,81.5 | v50.5,48 v55.5,48
SDA  (via drill 0.5)
  Top 0.406: U5.13.R 60.78,27.22 58.17,29.82 U3.13 53.67,29.82 v53,30.5 | v37.5,84.5 36.5,83.5 25,83.5 19.31,77.81 U$3.4.SDA 19.31,74.31 v16,71 | v47,83 47,81.2 U6.27 | v52,49.5 32,49.5 29.5,47 20,47 15.5,51.5 v15.5,66 | v52.5,36 51.5,37 51.5,45.92 v55.08,49.5 55.95,50.37 R5.2 56,55.95 | v90,83 78.5,83 74,78.5 74,59 67.5,52.5 v60.5,52.5
  Bottom 0.406: v37.5,84.5 45.5,84.5 v47,83 | v53,30.5 52.5,31 v52.5,36 | v15.5,66 15.5,70.5 v16,71 | v52,49.5 v55.08,49.5 58.08,52.5 v60.5,52.5 | U4.3 90.66,82.34 v90,83
VDD  (via drill 0.5, 1.1)  (3 unrouted)
  Top 0.406: C2.2 C1.2 44.45,42 43,42 40,45 U5.1.L 31.5,45 27.5,41 16,41 | U3.1 46.22,38.72 47,39.5 C2.2 | 16,41 10,41 8.46,42.54 J1.2 8.5,44.54 8.5,49 11.69,52.19 U$3.1.VDD 11.69,77.19 12.5,78 16,78 23.5,85.5 34.5,85.5 35,86 38,86 38.5,85.5 38.5,83.5 39,83 R10.1 41.55,78.71 C13.2 43,75.5 | v16,37.5 15.5,37 15.5,22 14,20.5 14,19.05 R8.1 15,19.95 15,20.5 15.5,21 R4.1 24.55,16.45 25.5,15.5 30,15.5 30.5,16 51,16 52.1,17.1 52.1,17.9 52.55,18.35 C3.2 | v57.5,16 54,16 53,17 53,18 52.55,18.45 C3.2 | LED1.4 52.55,18.4 C3.2 | C12.2 42.84,73 | J10.2 62.04,90.04 60.5,88.5 R11.1 60.55,87.5 61.5,87.5 v62.5,88.5 | v49.5,74 49.2,74 U6.6 46.7,71.5 44,71.5 42.67,72.83 C12.2 | v65,86 64,85 J6.2 | U6.4 45.66,72.73 43.77,72.73 43,73.5 C12.2 | C12.2 43.34,74 43.34,74.66 43,75 43,75.5 | R15.1 16,44.45 16,41 | 43,75.5 | C2.2 48.55,42.05 49.5,43 49.5,45 53.95,49.45 C6.2 | R6.1 R5.1 53.95,55.9 C6.2 | 54.04,53.41 C6.2 | v60,17.5 73,17.5 v77,13.5 77,7 78.54,5.46 J4.2 | J5.2 94.46,18.96 93,17.5 v83.5,17.5 | v85.9,28.72 v85.9,31.26 v85.9,33.8 v85.9,36.34 v85.9,38.88 v85.9,41.42 v85.9,43.96 v85.9,46.5 v85.9,49.04 v85.9,51.58 v85.9,54.12 v85.9,56.66 v85.9,59.2 v85.9,61.74 v85.9,64.28 v85.9,66.82 v85.9,74.44 85.9,76.9 93,84 95.12,84 U4.2 87.84,84.88 v78.74,93.98
  Bottom 0.406: v57.5,16 58.5,16 v60,17.5 | v16,37.5 13.5,37.5 8.46,42.54 J1.2 | J10.2 62.04,97.54 | 62.04,97.54 62.5,98 74.5,98 75.04,97.46 J11.2 75.04,95.14 76.2,93.98 v78.74,93.98 | J9.2 43.04,97.54 43.5,98 61.58,98 62.04,97.54 | J6.2 59.54,76.54 58,75 50.5,75 v49.5,74 | v62.5,88.5 v65,86 | v83.5,17.5 79.5,13.5 v77,13.5
  other vias: 85.9,71.9 85.9,69.36
XTAL1
  Top 0.406: U6.7 46.33,70 45.55,70 XTAL1.2 | XTAL1.2 XTAL1.4 | C7.2 43.77,67.28 XTAL1.2
XTAL2
  Top 0.406: U6.8 48,70.54 48,65.55 XTAL1.1 | C8.2 46.27,64.78 XTAL1.1 | XTAL1.3 XTAL1.1

### Text on the board
tPlace: AD7 | AD6 | RESET | VDD | GND | PC3 | PD2 | PD3 | PB2 | PD4 | PB1 | PB0 | PD7 | ATmega328 | PD6 | PD5 | PIC16F1829 | 3V3 | 5V | VDD | GND | Hello World! | RESET | RB7